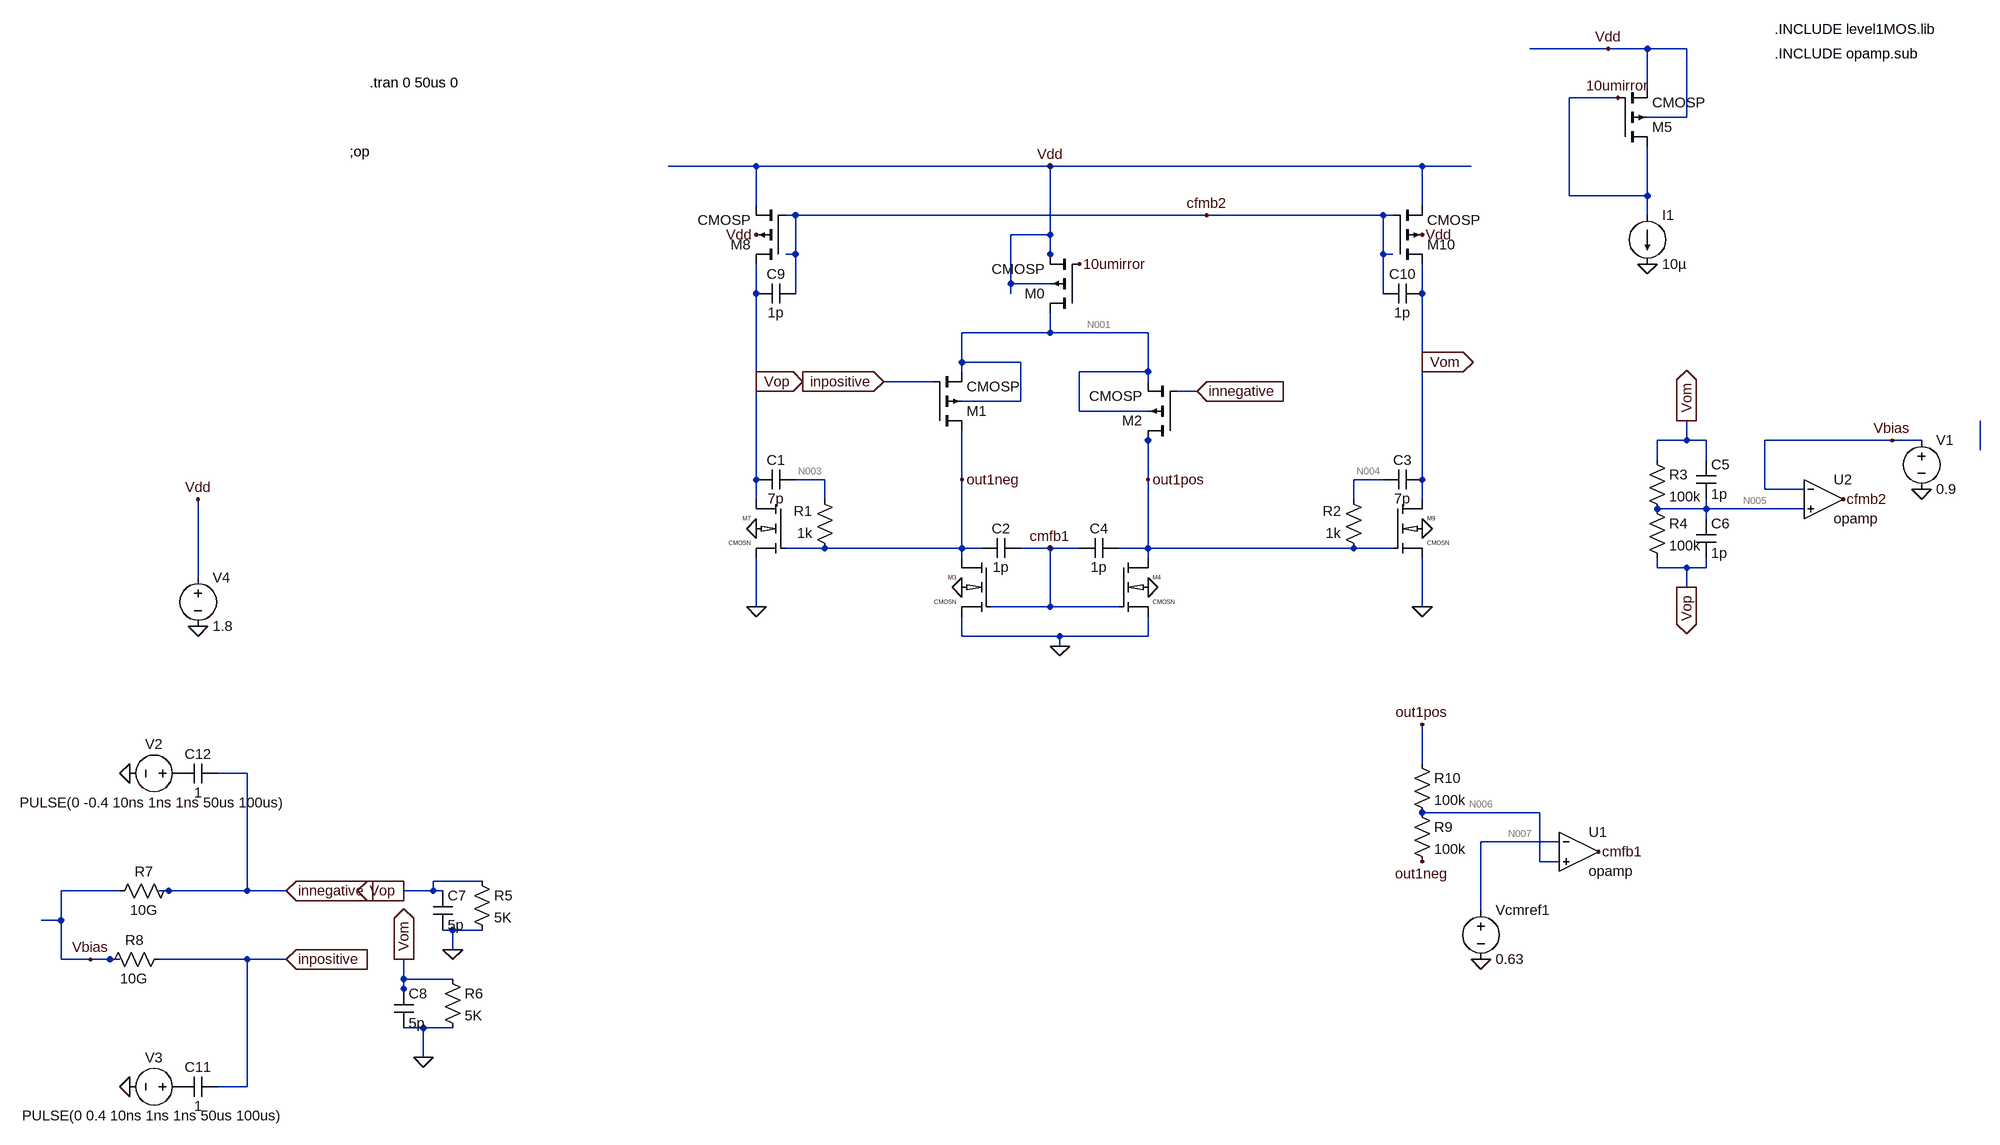
[diagram p0: schematic diffamp_idealfeedback.asc]
diffamp_idealfeedback.asc, the LTspice schematic file:
Version 4
SHEET 1 1904 1208
WIRE 896 -544 768 -544
WIRE 960 -544 896 -544
WIRE 1024 -544 960 -544
WIRE 960 -480 960 -544
WIRE 912 -464 832 -464
WIRE 1024 -432 1024 -544
WIRE 1024 -432 960 -432
WIRE -496 -352 -640 -352
WIRE -16 -352 -496 -352
WIRE 592 -352 -16 -352
WIRE 672 -352 592 -352
WIRE 832 -304 832 -464
WIRE 960 -304 960 -384
WIRE 960 -304 832 -304
WIRE -496 -288 -496 -352
WIRE 592 -288 592 -352
WIRE -432 -272 -448 -272
WIRE 240 -272 -432 -272
WIRE 528 -272 240 -272
WIRE 544 -272 528 -272
WIRE 960 -272 960 -304
WIRE -16 -240 -16 -352
WIRE -16 -240 -80 -240
WIRE -432 -208 -432 -272
WIRE -432 -208 -448 -208
WIRE -16 -208 -16 -240
WIRE 528 -208 528 -272
WIRE 544 -208 528 -208
WIRE -16 -192 -16 -208
WIRE -80 -160 -80 -240
WIRE -16 -160 -80 -160
WIRE -496 -144 -496 -192
WIRE -432 -144 -432 -208
WIRE -80 -144 -80 -160
WIRE 528 -144 528 -208
WIRE 592 -144 592 -192
WIRE -16 -80 -16 -112
WIRE -16 -80 -160 -80
WIRE 144 -80 -16 -80
WIRE -160 -32 -160 -80
WIRE -64 -32 -160 -32
WIRE 592 -32 592 -144
WIRE -160 -16 -160 -32
WIRE 144 -16 144 -80
WIRE 144 -16 32 -16
WIRE -496 0 -496 -144
WIRE -208 0 -288 0
WIRE 144 0 144 -16
WIRE 224 16 192 16
WIRE -64 32 -64 -32
WIRE -64 32 -160 32
WIRE 32 48 32 -16
WIRE 144 48 32 48
WIRE 144 96 144 80
WIRE 1024 96 1024 64
WIRE 1024 96 976 96
WIRE 1056 96 1024 96
WIRE 1360 96 1152 96
WIRE 1408 96 1360 96
WIRE 1504 112 1504 64
WIRE 976 128 976 96
WIRE 1056 128 1056 96
WIRE -496 160 -496 0
WIRE -384 160 -432 160
WIRE -160 160 -160 80
WIRE 144 160 144 96
WIRE 528 160 480 160
WIRE 592 160 592 -32
WIRE 1152 176 1152 96
WIRE 1216 176 1152 176
WIRE -496 192 -496 160
WIRE -384 192 -384 160
WIRE 480 192 480 160
WIRE 592 192 592 160
WIRE 1056 208 1056 192
WIRE 1056 208 976 208
WIRE 1216 208 1056 208
WIRE 1056 224 1056 208
WIRE -384 272 -448 272
WIRE -160 272 -160 160
WIRE -160 272 -384 272
WIRE -128 272 -160 272
WIRE -16 272 -64 272
WIRE 32 272 -16 272
WIRE 144 272 144 160
WIRE 144 272 96 272
WIRE 480 272 144 272
WIRE 544 272 480 272
WIRE -160 288 -160 272
WIRE 144 288 144 272
WIRE 976 304 976 288
WIRE 1024 304 976 304
WIRE 1056 304 1056 288
WIRE 1056 304 1024 304
WIRE -1408 320 -1408 192
WIRE 1024 336 1024 304
WIRE -496 368 -496 288
WIRE -16 368 -16 272
WIRE -16 368 -112 368
WIRE 96 368 -16 368
WIRE 592 368 592 288
WIRE -160 416 -160 384
WIRE 0 416 -160 416
WIRE 144 416 144 384
WIRE 144 416 0 416
WIRE 0 432 0 416
WIRE 592 624 592 560
WIRE -1328 640 -1376 640
WIRE 784 704 592 704
WIRE 816 752 688 752
WIRE 784 784 784 704
WIRE 816 784 784 784
WIRE -944 816 -1024 816
WIRE -1536 832 -1632 832
WIRE -1456 832 -1472 832
WIRE -1328 832 -1328 640
WIRE -1328 832 -1456 832
WIRE -1264 832 -1328 832
WIRE -1024 832 -1024 816
WIRE -1024 832 -1072 832
WIRE -1008 832 -1024 832
WIRE 688 864 688 752
WIRE -1632 880 -1632 832
WIRE -1632 880 -1664 880
WIRE -992 896 -1008 896
WIRE -944 896 -992 896
WIRE -992 928 -992 896
WIRE -1632 944 -1632 880
WIRE -1584 944 -1632 944
WIRE -1552 944 -1584 944
WIRE -1536 944 -1552 944
WIRE -1328 944 -1472 944
WIRE -1264 944 -1328 944
WIRE -1072 976 -1072 944
WIRE -992 976 -1072 976
WIRE -1072 992 -1072 976
WIRE -1072 1008 -1072 992
WIRE -1040 1056 -1072 1056
WIRE -992 1056 -1040 1056
WIRE -1040 1104 -1040 1056
WIRE -1328 1152 -1328 944
WIRE -1328 1152 -1376 1152
FLAG 224 16 innegative
IOPIN 224 16 In
FLAG -288 0 inpositive
IOPIN -288 0 In
FLAG -160 160 out1neg
FLAG 144 160 out1pos
FLAG 960 -192 0
FLAG 688 944 0
FLAG 896 -544 Vdd
FLAG 592 784 out1neg
FLAG 592 560 out1pos
FLAG -16 272 cmfb1
FLAG 880 768 cmfb1
FLAG 32 -192 10umirror
FLAG 912 -464 10umirror
FLAG 0 432 0
FLAG 144 336 0
FLAG -160 336 0
FLAG -1408 400 0
FLAG -496 368 0
FLAG 592 368 0
FLAG -1408 192 Vdd
FLAG 240 -272 cfmb2
FLAG 592 -32 Vom
IOPIN 592 -32 Out
FLAG -496 0 Vop
IOPIN -496 0 Out
FLAG -16 -352 Vdd
FLAG -496 240 0
FLAG 592 240 0
FLAG -496 -240 Vdd
FLAG 592 -240 Vdd
FLAG 1280 192 cfmb2
FLAG 1408 176 0
FLAG 1024 64 Vom
IOPIN 1024 64 Out
FLAG 1024 336 Vop
IOPIN 1024 336 Out
FLAG -1264 832 innegative
IOPIN -1264 832 In
FLAG -1264 944 inpositive
IOPIN -1264 944 In
FLAG -1072 832 Vop
IOPIN -1072 832 Out
FLAG -1072 944 Vom
IOPIN -1072 944 Out
FLAG 1360 96 Vbias
FLAG -992 928 0
FLAG -1040 1104 0
FLAG -1520 640 0
FLAG -1520 1152 0
FLAG -1584 944 Vbias
SYMBOL cmosn -112 288 M0
SYMATTR InstName M3
SYMATTR Value2 l=0.24u w=2u
SYMBOL cmosp -208 80 M180
SYMATTR InstName M1
SYMATTR Value2 l=0.24u w=32u
SYMBOL cmosp 32 -112 R180
SYMATTR InstName M0
SYMATTR Value2 l=0.24u w=64u
SYMBOL cmosp 192 96 R180
SYMATTR InstName M2
SYMATTR Value2 l=0.24u w=32u
SYMBOL cmosn 96 288 R0
SYMATTR InstName M4
SYMATTR Value2 l=0.24u w=2u
SYMBOL cmosp 912 -384 M180
SYMATTR InstName M5
SYMATTR Value2 l=0.24u w=6.4u
SYMBOL current 960 -272 R0
WINDOW 123 0 0 Left 2
WINDOW 39 0 0 Left 2
SYMATTR Value2 ""
SYMATTR SpiceLine ""
SYMATTR InstName I1
SYMATTR Value 10µ
SYMBOL voltage -1408 304 R0
WINDOW 123 0 0 Left 2
WINDOW 39 0 0 Left 2
SYMATTR Value2 ""
SYMATTR SpiceLine ""
SYMATTR InstName V4
SYMATTR Value 1.8
SYMBOL cap -64 256 R90
WINDOW 0 0 32 VBottom 2
WINDOW 3 32 32 VTop 2
SYMATTR InstName C2
SYMATTR Value 1p
SYMBOL cap 96 256 R90
WINDOW 0 0 32 VBottom 2
WINDOW 3 32 32 VTop 2
SYMATTR InstName C4
SYMATTR Value 1p
SYMBOL voltage 688 848 R0
WINDOW 123 0 0 Left 2
WINDOW 39 0 0 Left 2
SYMATTR Value2 ""
SYMATTR SpiceLine ""
SYMATTR InstName Vcmref1
SYMATTR Value 0.63
SYMBOL cmosn -448 192 M0
SYMATTR InstName M7
SYMATTR Value2 l=0.24u w=4u
SYMBOL cmosp -448 -192 R180
SYMATTR InstName M8
SYMATTR Value2 l=0.24u w=16u
SYMBOL cmosn 544 192 R0
SYMATTR InstName M9
SYMATTR Value2 l=0.24u w=4u
SYMBOL cmosp 544 -192 M180
SYMATTR InstName M10
SYMATTR Value2 l=0.24u w=16u
SYMBOL cap -432 144 R90
WINDOW 0 0 32 VBottom 2
WINDOW 3 32 32 VTop 2
SYMATTR InstName C1
SYMATTR Value 7p
SYMBOL res -368 288 R180
WINDOW 0 36 76 Left 2
WINDOW 3 36 40 Left 2
SYMATTR InstName R1
SYMATTR Value 1k
SYMBOL cap 528 144 M90
WINDOW 0 0 32 VBottom 2
WINDOW 3 32 32 VTop 2
SYMATTR InstName C3
SYMATTR Value 7p
SYMBOL res 496 288 R180
WINDOW 0 36 76 Left 2
WINDOW 3 36 40 Left 2
SYMATTR InstName R2
SYMATTR Value 1k
SYMBOL voltage 1408 80 R0
WINDOW 123 0 0 Left 2
WINDOW 39 0 0 Left 2
SYMATTR Value2 ""
SYMATTR SpiceLine ""
SYMATTR InstName V1
SYMATTR Value 0.9
SYMBOL res 960 112 R0
SYMATTR InstName R3
SYMATTR Value 100k
SYMBOL res 960 192 R0
SYMATTR InstName R4
SYMATTR Value 100k
SYMBOL cap 1040 128 R0
SYMATTR InstName C5
SYMATTR Value 1p
SYMBOL cap 1040 224 R0
SYMATTR InstName C6
SYMATTR Value 1p
SYMBOL cap -432 -160 R90
WINDOW 0 0 32 VBottom 2
WINDOW 3 32 32 VTop 2
SYMATTR InstName C9
SYMATTR Value 1p
SYMBOL cap 592 -160 R90
WINDOW 0 0 32 VBottom 2
WINDOW 3 32 32 VTop 2
SYMATTR InstName C10
SYMATTR Value 1p
SYMBOL cap -1024 832 R0
SYMATTR InstName C7
SYMATTR Value 5p
SYMATTR SpiceLine ""
SYMBOL cap -1088 992 R0
SYMATTR InstName C8
SYMATTR Value 5p
SYMATTR SpiceLine ""
SYMBOL res -960 800 R0
SYMATTR InstName R5
SYMATTR Value 5K
SYMATTR SpiceLine ""
SYMBOL res -1008 960 R0
SYMATTR InstName R6
SYMATTR Value 5K
SYMATTR SpiceLine ""
SYMBOL voltage -1424 640 R90
WINDOW 0 -32 56 VBottom 2
WINDOW 3 32 56 VTop 2
WINDOW 123 0 0 Left 2
WINDOW 39 0 0 Left 2
SYMATTR InstName V2
SYMATTR Value PULSE(0 -0.4 10ns 1ns 1ns 50us 100us)
SYMATTR Value2 ""
SYMATTR SpiceLine ""
SYMBOL voltage -1424 1152 R90
WINDOW 0 -32 56 VBottom 2
WINDOW 3 32 56 VTop 2
WINDOW 123 0 0 Left 2
WINDOW 39 0 0 Left 2
SYMATTR InstName V3
SYMATTR Value PULSE(0 0.4 10ns 1ns 1ns 50us 100us)
SYMATTR Value2 ""
SYMATTR SpiceLine ""
SYMBOL cap -1376 1136 R90
WINDOW 0 0 32 VBottom 2
WINDOW 3 32 32 VTop 2
SYMATTR InstName C11
SYMATTR Value 1
SYMATTR SpiceLine ""
SYMBOL cap -1376 624 R90
WINDOW 0 0 32 VBottom 2
WINDOW 3 32 32 VTop 2
SYMATTR InstName C12
SYMATTR Value 1
SYMATTR SpiceLine ""
SYMBOL res -1440 816 R90
WINDOW 0 0 56 VBottom 2
WINDOW 3 32 56 VTop 2
SYMATTR InstName R7
SYMATTR Value 10G
SYMATTR SpiceLine ""
SYMBOL res -1456 928 R90
WINDOW 0 0 56 VBottom 2
WINDOW 3 32 56 VTop 2
SYMATTR InstName R8
SYMATTR Value 10G
SYMATTR SpiceLine ""
SYMBOL Opamps\\opamp 848 704 R0
SYMATTR InstName U1
SYMBOL res 576 688 R0
SYMATTR InstName R9
SYMATTR Value 100k
SYMATTR SpiceLine ""
SYMBOL res 576 608 R0
SYMATTR InstName R10
SYMATTR Value 100k
SYMATTR SpiceLine ""
SYMBOL Opamps\\opamp 1248 128 R0
SYMATTR InstName U2
TEXT 1168 -576 Left 2 !.INCLUDE level1MOS.lib
TEXT 1168 -536 Left 2 !.INCLUDE opamp.sub
TEXT -1128 -488 Left 2 !.tran 0 50us 0
TEXT -1160 -376 Left 2 !;op

The netlist it stands for:
* diffamp_idealfeedback.asc
M3 out1neg cmfb1 0 0 CMOSN l=0.24u w=2u
M1 out1neg inpositive N001 N001 CMOSP l=0.24u w=32u
M0 N001 10umirror Vdd Vdd CMOSP l=0.24u w=64u
M2 out1pos innegative N001 N001 CMOSP l=0.24u w=32u
M4 out1pos cmfb1 0 0 CMOSN l=0.24u w=2u
M5 10umirror 10umirror Vdd Vdd CMOSP l=0.24u w=6.4u
I1 10umirror 0 10µ
V4 Vdd 0 1.8
C2 cmfb1 out1neg 1p
C4 out1pos cmfb1 1p
Vcmref1 N007 0 0.63
M7 Vop out1neg 0 0 CMOSN l=0.24u w=4u
M8 Vop cfmb2 Vdd Vdd CMOSP l=0.24u w=16u
M9 Vom out1pos 0 0 CMOSN l=0.24u w=4u
M10 Vom cfmb2 Vdd Vdd CMOSP l=0.24u w=16u
C1 N003 Vop 7p
R1 out1neg N003 1k
C3 N004 Vom 7p
R2 out1pos N004 1k
V1 Vbias 0 0.9
R3 Vom N005 100k
R4 N005 Vop 100k
C5 Vom N005 1p
C6 N005 Vop 1p
C9 cfmb2 Vop 1p
C10 Vom cfmb2 1p
C7 Vop 0 5p
C8 Vom 0 5p
R5 Vop 0 5K
R6 Vom 0 5K
V2 P001 0 PULSE(0 -0.4 10ns 1ns 1ns 50us 100us)
V3 P002 0 PULSE(0 0.4 10ns 1ns 1ns 50us 100us)
C11 inpositive P002 1
C12 innegative P001 1
R7 innegative Vbias 10G
R8 inpositive Vbias 10G
XU1 N007 N006 cmfb1 opamp Aol=100K GBW=10Meg  ; pins invin noninvin out
R9 N006 out1neg 100k
R10 out1pos N006 100k
XU2 Vbias N005 cfmb2 opamp Aol=100K GBW=10Meg  ; pins invin noninvin out
.model NMOS NMOS
.model PMOS PMOS
.lib standard.mos
.INCLUDE level1MOS.lib
.INCLUDE opamp.sub
.tran 0 50us 0
;op
.lib tsmc018.lib
.backanno
.end

* Results of the author's LTspice run, read from the files saved beside the schematic
* Operating Point, zero values left out:
*   V(out1neg) = 630 mV
*   V(cmfb1) = 671.8 mV
*   V(inpositive) = 891.1 mV
*   V(n001) = 1.457 V
*   V(10umirror) = 1.232 V
*   V(vdd) = 1.8 V
*   V(out1pos) = 630 mV
*   V(innegative) = 891.1 mV
*   V(n007) = 630 mV
*   V(vop) = 900 mV
*   V(cfmb2) = 1.043 V
*   V(vom) = 900 mV
*   V(n003) = 630 mV
*   V(n004) = 630 mV
*   V(vbias) = 900 mV
*   V(n005) = 900 mV
*   V(n006) = 630 mV
*   Id(M10) = -242.6 µA
*   Is(M10) = 242.6 µA
*   Id(M8) = -242.6 µA
*   Is(M8) = 242.6 µA
*   Id(M5) = -10 µA
*   Is(M5) = 10 µA
*   Id(M2) = -49.04 µA
*   Is(M2) = 49.04 µA
*   Id(M0) = -98.07 µA
*   Is(M0) = 98.07 µA
*   Id(M1) = -49.04 µA
*   Is(M1) = 49.04 µA
*   Id(M9) = 62.61 µA
*   Is(M9) = -62.61 µA
*   Id(M7) = 62.61 µA
*   Is(M7) = -62.61 µA
*   Id(M4) = 49.04 µA
*   Is(M4) = -49.04 µA
*   Id(M3) = 49.04 µA
*   Is(M3) = -49.04 µA
*   I(I1) = 10 µA
*   I(R6) = 180 µA
*   I(R5) = 180 µA
*   I(V1) = -1.782 pA
*   I(V4) = -593.3 µA
*   Ix(u1:3) = 2.861 pA
*   Ix(u2:3) = -3.427 pA